# EAGLE design tag (EAGLE 7.7.0)
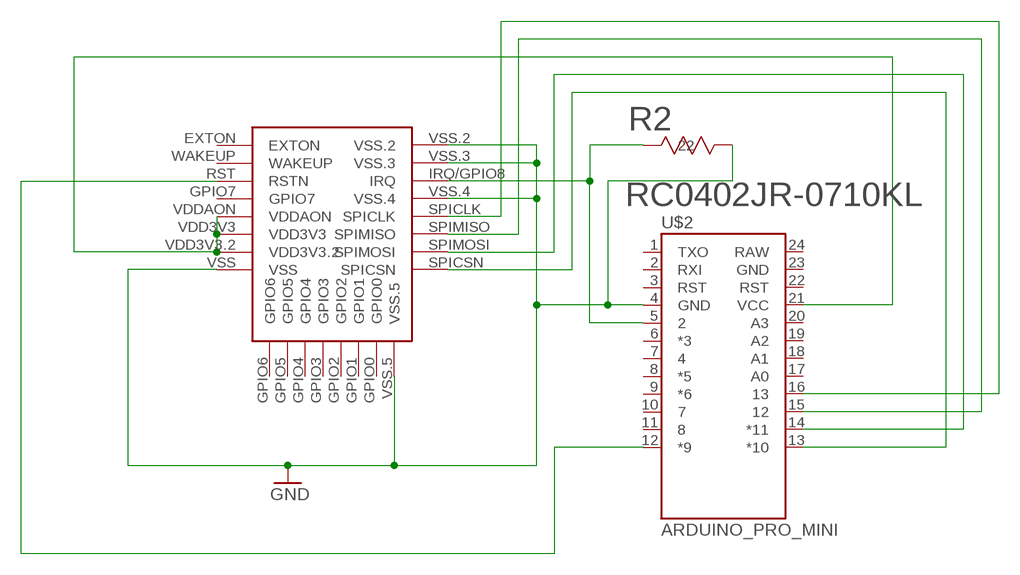
[diagram p0: schematic, sheet 1]

## Parts
R2  RC0402JR-0710KL  [RC0402N]
U$1  DWM1000  [DWM1000]
U$2  ARDUINO_PRO_MINI  [ARDUINO_PRO_MINI]

## Nets
GND: R2.1 U$1.VSS U$1.VSS.2 U$1.VSS.3 U$1.VSS.4 U$1.VSS.5 U$2.4(GND)
N$1: U$1.VDD3V3 U$1.VDD3V3.2 U$1.VDDAON U$2.21(VCC)
N$3: R2.2 U$1.IRQ/GPIO8(IRQ) U$2.5
N$4: U$1.RST(RSTN) U$2.12(*9)
N$5: U$1.SPIMISO U$2.15
N$6: U$1.SPICLK U$2.16
N$7: U$1.SPIMOSI U$2.14(*11)
N$8: U$1.SPICSN U$2.13(*10)
Unconnected: U$1.EXTON U$1.GPIO0 U$1.GPIO1 U$1.GPIO2 U$1.GPIO3 U$1.GPIO4 U$1.GPIO5 U$1.GPIO6 U$1.GPIO7 U$1.WAKEUP U$2.1(TXO) U$2.2(RXI) U$2.3(RST) U$2.6(*3) U$2.7 U$2.8(*5) U$2.9(*6) U$2.10 U$2.11 U$2.17(A0) U$2.18(A1) U$2.19(A2) U$2.20(A3) U$2.22(RST) U$2.23(GND) U$2.24(RAW)

## Library data of the parts
R2 = untitled:RC0402JR-0710KL; CASE: 0402 1005 metric; COMPOSITION: Thick Film; COPYRIGHT: Copyright C 2015 Accelerated Designs. All rights reserved; DATASHEET: httpwww.yageo.comdocumentsrecentPYuRC0402_51_RoHS_L_6.pdf; DIGIKEYPARTNUMBER: 31110KJRTRND; HEIGHT: 0.016" 0.40mm; LEADSTYLE: Surface Mount SMD SMT; MANUFACTURER_PART_NUMBER: RC0402JR0710KL; NEWARKPARTNUMBER: 67R9964; NUMBEROFTERMINATIONS: 2; PACKAGECASE: 0402 1005 Metric; PACKAGING: Tape &amp Reel TR; POWERWATTS: 0.063W 116W; QUANTITY_AVAILABLE: 0; RESISTANCEINOHMS: 10.0K; RESISTANCEOHMS: 10K; SIZEDIMENSION: 0.039" L x 0.020" W 1.00mm x 0.50mm; TEMPERATURECOEFFICIENT: 100ppm°C; TOLERANCE: 5%; VENDOR: Yageo; VOLTAGEWORKING: 50V
U$1 = DWM1000:DWM1000
U$2 = SparkFun-Boards:ARDUINO_PRO_MINI

## Board
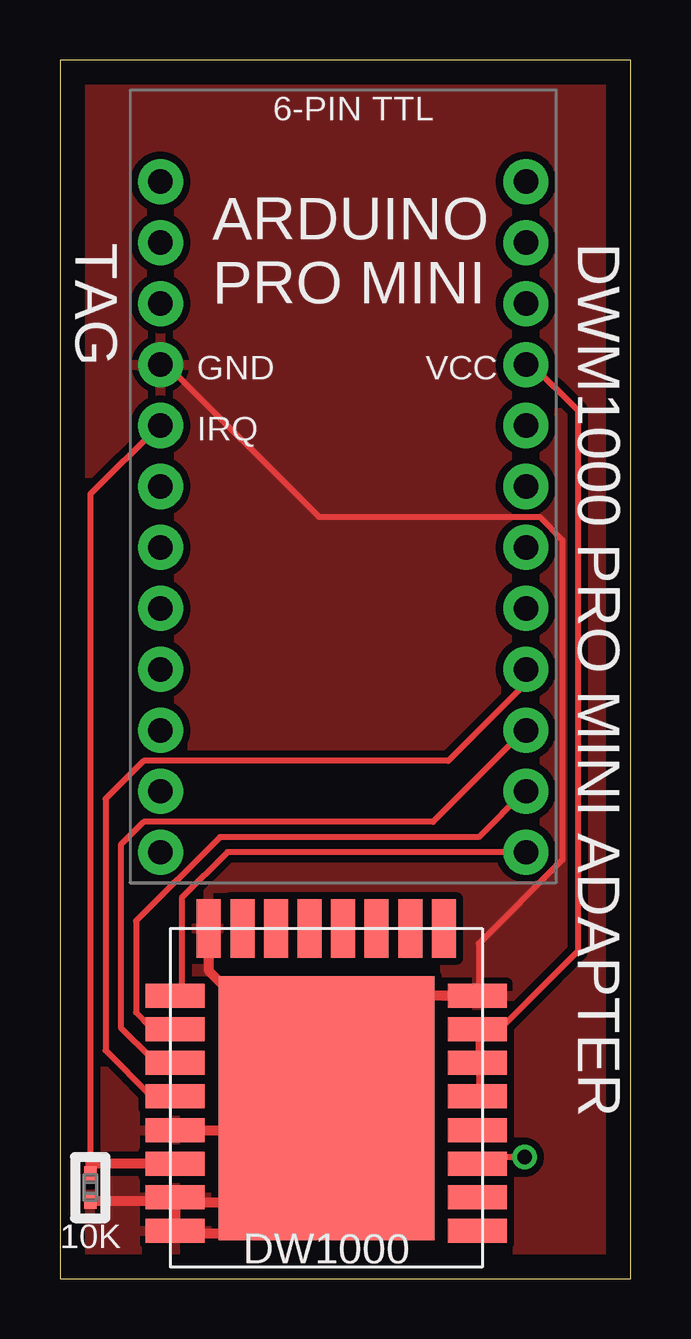
[diagram p1: board, top side]
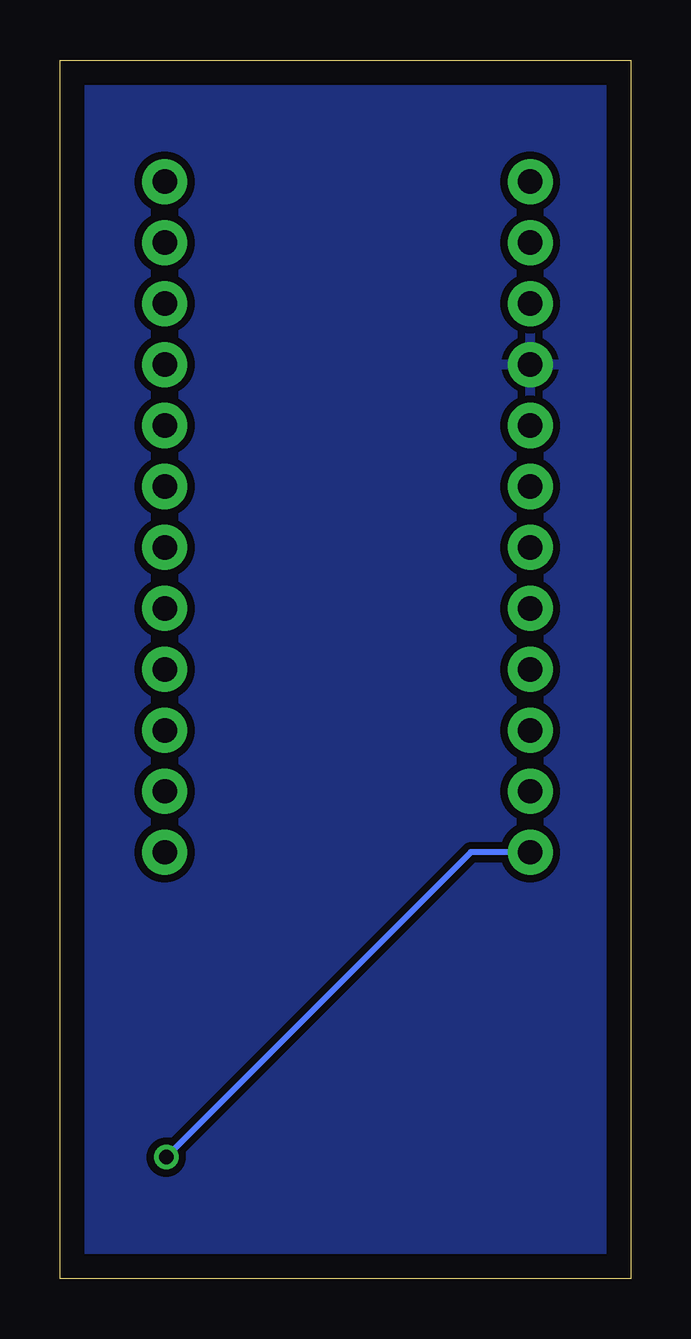
[diagram p2: board, bottom side, seen from below]

Size 23.8 x 50.79 mm. Coordinates in mm from the lower left corner, seen from the top.
Outline: 0,0 23.8,0 23.8,50.79 0,50.79 0,0
Copper layers (1*16): Top 0.035mm / dielectric 1.5mm / Bottom 0.035mm
Design rules "default": minimum track width 10mil, minimum drill 24mil, track to track 8mil, track to pad 8mil, pad to pad 8mil, via to via 8mil, smd to smd 8mil, copper to edge 40mil, drill to drill 8mil, minimum pad ring 10mil, minimum via ring 8mil, stop-mask expansion 4mil, vias tented up to drill 0mil, thermal gap 10mil

### Footprints (pad centres in the part's own frame; a part is rotated, then mirrored left to right if it is on the bottom)
RC0402N = smd 0.66 x 0.508: 1 -0.559,0; 2 0.559,0
DWM1000 = smd 2.45 x 1: EXTON -2.8,12.6; GPIO7 -2.8,8.4; IRQ/GPIO8 9.8,9.8; RST -2.8,9.8; SPICLK 9.8,7; SPICSN 9.8,2.8; SPIMISO 9.8,5.6; SPIMOSI 9.8,4.2; VDD3V3 -2.8,4.2; VDD3V3.2 -2.8,5.6; VDDAON -2.8,7; VSS -2.8,2.8; VSS.2 9.8,12.6; VSS.3 9.8,11.2; VSS.4 9.8,8.4; WAKEUP -2.8,11.2 | smd 9 x 11: GND 3.5,7.5 | smd 1 x 2.45: GPIO0 7,0; GPIO1 5.6,0; GPIO2 4.2,0; GPIO3 2.8,0; GPIO4 1.4,0; GPIO5 0,0; GPIO6 -1.4,0; VSS.5 8.4,0
ARDUINO_PRO_MINI = drill 1.016 pad 1.88: 1 -7.62,12.7; 2 -7.62,10.16; 3 -7.62,7.62; 4 -7.62,5.08; 5 -7.62,2.54; 6 -7.62,0; 7 -7.62,-2.54; 8 -7.62,-5.08; 9 -7.62,-7.62; 10 -7.62,-10.16; 11 -7.62,-12.7; 12 -7.62,-15.24; 13 7.62,-15.24; 14 7.62,-12.7; 15 7.62,-10.16; 16 7.62,-7.62; 17 7.62,-5.08; 18 7.62,-2.54; 19 7.62,0; 20 7.62,2.54; 21 7.62,5.08; 22 7.62,7.62; 23 7.62,10.16; 24 7.62,12.7

### Placement (x,y rotation side)
R2  1.27,3.81 90 top
U$1  14.61,14.61 180 top
U$2  11.81,33.02 0 top

### Tracks (layer width: path | path; a pad name or v marks a point on that pad's centre or on a via)
GND
  Top 0.254: 4.76,3.17 U$1.VSS.3 | U$1.VSS 17.46,12.07 17.46,13.97 20.95,17.46 20.95,30.8 20,31.75 10.79,31.75 4.45,38.1 U$2.4
  Top 0.406: U$1.VSS.4 7.62,6.21 | 7.62,6.21 7.62,6.35 10.16,8.89 | 4.8,3.17 7.62,3.17 7.62,6.21 | 4.8,3.17 U$1.VSS.2 4.8,1.9 6.99,1.9 | R2.1 3.81,3.25 3.81,3.17 4.76,3.17 4.8,3.17 | U$1.VSS 15.24,11.8 15.24,11.43 12.7,11.43 10.16,8.89 | U$1.VSS.5 6.21,12.84 10.16,8.89
  pour Top (isolate 0.305): 0,50.8 24.13,50.8 24.13,0 0,0
  pour Bottom (isolate 0.305): 0,50.8 24.13,50.8 24.13,0 0,0
N$1
  Top 0.254: U$1.VDDAON 17.46,7.62 17.46,8.89 U$1.VDD3V3.2 17.46,9.21 17.46,10.16 U$1.VDD3V3 17.46,10.48 18.41,10.48 21.59,13.65 21.59,36.2 19.68,38.1 U$2.21
N$3
  Top 0.254: 1.27,4.76 1.27,32.7 4.13,35.56 U$2.5
  Top 0.406: U$1.IRQ/GPIO8 1.27,4.8 1.27,4.76 R2.2
N$4  (via drill 0.61)
  Top 0.254: v19.37,5.08 17.46,5.08 U$1.RST
  Bottom 0.254: v19.37,5.08 6.67,17.78 U$2.12
N$5
  Top 0.254: U$1.SPIMISO 4.76,9.21 3.81,9.21 2.54,10.48 2.54,18.1 3.49,19.05 15.56,19.05 19.37,22.86 U$2.15
N$6
  Top 0.254: U$1.SPICLK 4.76,7.62 3.81,7.62 1.91,9.53 1.91,20 3.49,21.59 16.19,21.59 19.37,24.76 19.37,25.4 U$2.16
N$7
  Top 0.254: U$1.SPIMOSI 4.76,10.48 3.81,10.48 3.17,11.11 3.17,14.92 6.67,18.41 17.46,18.41 19.37,20.32 U$2.14
N$8
  Top 0.254: U$2.13 6.99,17.78 5.08,15.87 5.08,12.07 U$1.SPICSN

### Text on the board
tPlace: 6-PIN TTL | TAG | DWM1000 PRO MINI ADAPTER | ARDUINO / PRO MINI | GND | VCC | IRQ | 10K